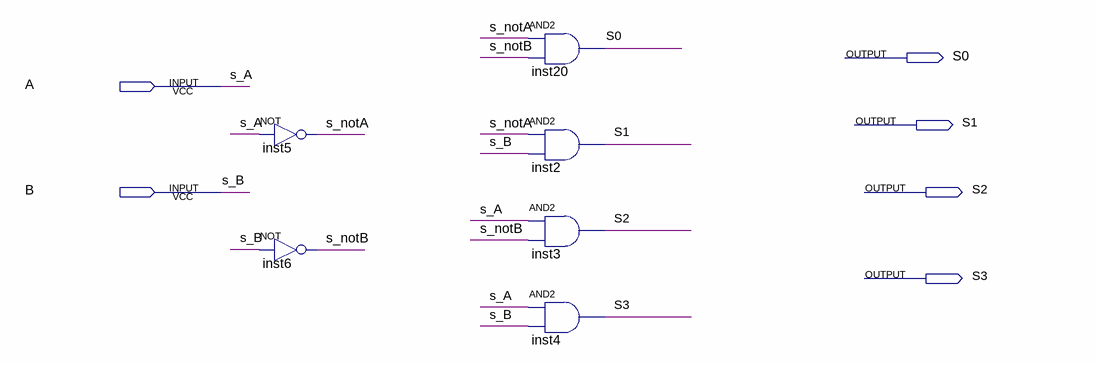
[diagram p0: schematic sheet]
// Quartus schematic decoder2to4.bdf as structural Verilog: 6 symbols, 6 pins
module decoder2to4 (
  input  A,
  input  B,
  output S0,
  output S1,
  output S2,
  output S3
);

  wire s_notA, s_notB;

  not inst5 (s_notA, A);
  not inst6 (s_notB, B);
  and inst20 (S0, s_notA, s_notB);
  and inst2 (S1, s_notA, B);
  and inst3 (S2, A, s_notB);
  and inst4 (S3, A, B);

  // Other names for the same wires on the sheet: s_A = A; s_B = B
endmodule
